# EAGLE design sound (EAGLE 5.11)
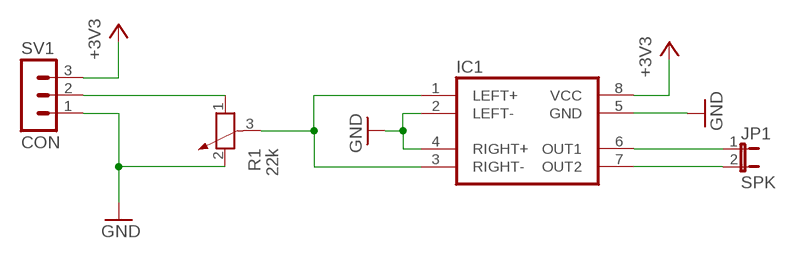
[diagram p0: schematic, sheet 1]

## Parts
IC1  TDA7050  [DIL08]
JP1  SPK  JP1E  [JP1]
R1  22k  POTENTIOMETER_PT-10  [PT-10]
SV1  CON  MA03-1  [MA03-1]

## Nets
+3V3: IC1.8(VCC) SV1.3
GND: IC1.2(LEFT-) IC1.4(RIGHT+) IC1.5(GND) R1.2 SV1.1
N$1: R1.1 SV1.2
N$2: IC1.1(LEFT+) IC1.3(RIGHT-) R1.3
N$3: IC1.6(OUT1) JP1.1
N$4: IC1.7(OUT2) JP1.2

## Library data of the parts
IC1 = tda7050:TDA7050
JP1 = jumper:JP1E: JUMPER
R1 = rcl:POTENTIOMETER_: Potentiometer
SV1 = con-lstb:MA03-1: PIN HEADER; OC_FARNELL: unknown; OC_NEWARK: unknown

## Board
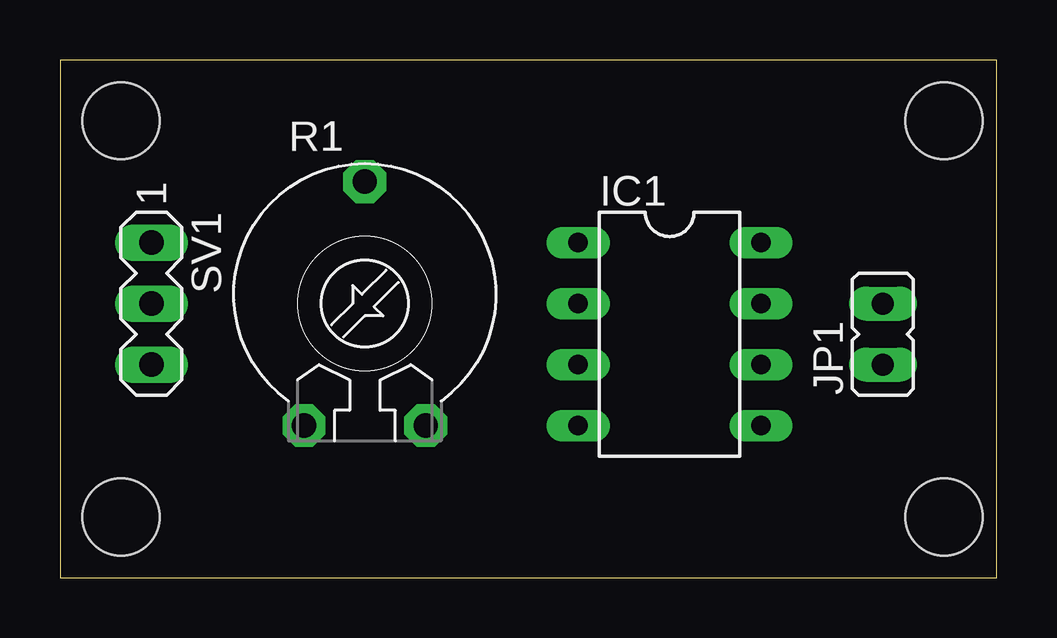
[diagram p1: board, top side]
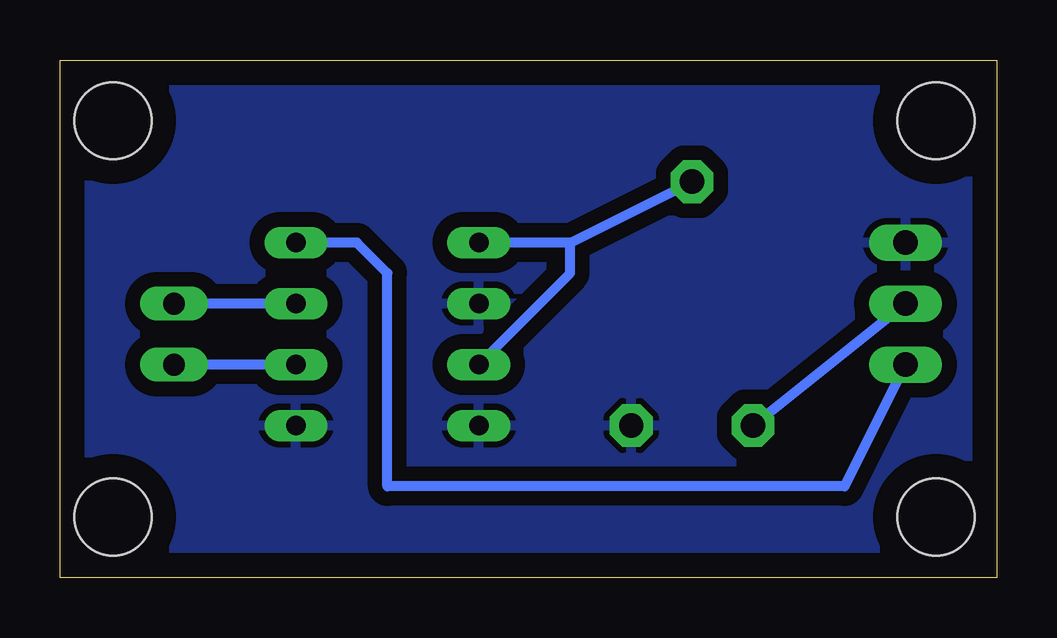
[diagram p2: board, bottom side, seen from below]

Size 39.04 x 21.58 mm. Coordinates in mm from the lower left corner, seen from the top.
Outline: 0,0 39.04,0 39.04,21.58 0,21.58 0,0
Copper layers (1*16): Top 0.035mm / dielectric 1.5mm / Bottom 0.035mm
Design rules "default": minimum track width 10mil, minimum drill 24mil, track to track 8mil, track to pad 8mil, pad to pad 8mil, via to via 8mil, smd to smd 8mil, copper to edge 40mil, drill to drill 8mil, minimum pad ring 10mil, minimum via ring 8mil, stop-mask expansion 4mil, vias tented up to drill 0mil, thermal gap 10mil
Holes 3.2 mm at 2.54,2.54 36.83,2.54 2.54,19.05 36.83,19.05

### Footprints (pad centres in the part's own frame; a part is rotated, then mirrored left to right if it is on the bottom)
DIL08 = drill 0.813 long: 1 -3.81,-3.81; 2 -1.27,-3.81; 3 1.27,-3.81; 4 3.81,-3.81; 5 3.81,3.81; 6 1.27,3.81; 7 -1.27,3.81; 8 -3.81,3.81
JP1 = drill 0.914 long: 1 0,-1.27; 2 0,1.27
PT-10 = drill 1.016 pad 1.778 octagon: 1 -2.54,-5.08; 2 2.54,-5.08; 3 0,5.08
MA03-1 = drill 1.016 long: 1 -2.54,0; 2 0,0; 3 2.54,0

### Placement (x,y rotation side)
IC1  25.4,10.16 270 top
JP1  34.29,10.16 0 top
R1  12.7,11.43 0 top
SV1  3.81,11.43 270 top

### Tracks (layer width: path | path; a pad name or v marks a point on that pad's centre or on a via)
+3V3
  Bottom 0.406: IC1.8 26.67,13.97 25.4,12.7 25.4,3.81 6.35,3.81 SV1.3
GND
  pour Bottom (isolate 0.61): 0,21.59 0,0 39.37,0 39.37,21.59
N$1
  Bottom 0.406: SV1.2 R1.1
N$2
  Bottom 0.406: 17.78,13.97 R1.3 | 17.78,13.97 17.78,12.7 IC1.3 | 17.78,13.97 IC1.1
N$3
  Bottom 0.406: IC1.6 JP1.1
N$4
  Bottom 0.406: IC1.7 JP1.2